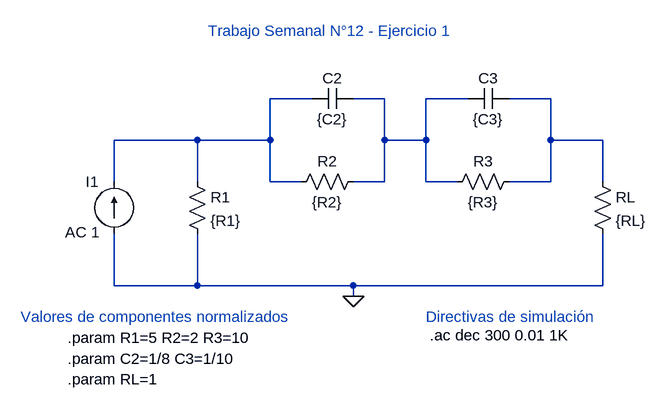
[diagram p0: schematic TS12_ej1.asc]
TS12_ej1.asc, the LTspice schematic file:
Version 4
SHEET 1 880 680
WIRE 352 0 288 0
WIRE 464 0 416 0
WIRE 592 0 528 0
WIRE 720 0 656 0
WIRE 176 64 48 64
WIRE 288 64 288 0
WIRE 288 64 176 64
WIRE 464 64 464 0
WIRE 528 64 528 0
WIRE 528 64 464 64
WIRE 720 64 720 0
WIRE 800 64 720 64
WIRE 48 128 48 64
WIRE 176 128 176 64
WIRE 288 128 288 64
WIRE 336 128 288 128
WIRE 464 128 464 64
WIRE 464 128 416 128
WIRE 528 128 528 64
WIRE 576 128 528 128
WIRE 720 128 720 64
WIRE 720 128 656 128
WIRE 800 128 800 64
WIRE 48 288 48 208
WIRE 176 288 176 208
WIRE 176 288 48 288
WIRE 416 288 176 288
WIRE 800 288 800 208
WIRE 800 288 416 288
WIRE 416 304 416 288
FLAG 416 304 0
SYMBOL current 48 208 R180
WINDOW 0 24 80 Left 2
WINDOW 3 24 0 Left 2
WINDOW 123 22 2 Left 2
WINDOW 39 0 0 Left 0
SYMATTR InstName I1
SYMATTR Value ""
SYMATTR Value2 AC 1
SYMBOL res 160 112 R0
SYMATTR InstName R1
SYMATTR Value {R1}
SYMBOL res 432 112 R90
WINDOW 0 0 56 VBottom 2
WINDOW 3 32 56 VTop 2
SYMATTR InstName R2
SYMATTR Value {R2}
SYMBOL cap 416 -16 R90
WINDOW 0 0 32 VBottom 2
WINDOW 3 32 32 VTop 2
SYMATTR InstName C2
SYMATTR Value {C2}
SYMBOL cap 656 -16 R90
WINDOW 0 0 32 VBottom 2
WINDOW 3 32 32 VTop 2
SYMATTR InstName C3
SYMATTR Value {C3}
SYMBOL res 672 112 R90
WINDOW 0 0 56 VBottom 2
WINDOW 3 32 56 VTop 2
SYMATTR InstName R3
SYMATTR Value {R3}
SYMBOL res 784 112 R0
SYMATTR InstName RL
SYMATTR Value {RL}
TEXT 192 -104 Left 2 ;Trabajo Semanal N°12 - Ejercicio 1
TEXT -96 336 Left 2 ;Valores de componentes normalizados
TEXT -24 368 Left 2 !.param R1=5 R2=2 R3=10
TEXT -24 400 Left 2 !.param C2=1/8 C3=1/10
TEXT -24 432 Left 2 !.param RL=1
TEXT 528 336 Left 2 ;Directivas de simulación
TEXT 534 364 Left 2 !.ac dec 300 0.01 1K

The netlist it stands for:
* TS12_ej1.asc
I1 0 N001 AC 1
R1 N001 0 {R1}
R2 N002 N001 {R2}
C2 N002 N001 {C2}
C3 N003 N002 {C3}
R3 N003 N002 {R3}
RL N003 0 {RL}
* Trabajo Semanal N°12 - Ejercicio 1
* Valores de componentes normalizados
.param R1=5 R2=2 R3=10
.param C2=1/8 C3=1/10
.param RL=1
* Directivas de simulación
.ac dec 300 0.01 1K
.backanno
.end